# Altium schematic sheet State.schdoc: State Machine
size A; Organization: Altium Limited; Address1: L3, 12a Rodborough Rd; Address2: Frenchs Forest; Address3: NSW; Address4: Australia 2086; DocumentNumber: 1; SheetNumber: 1; SheetTotal: 1
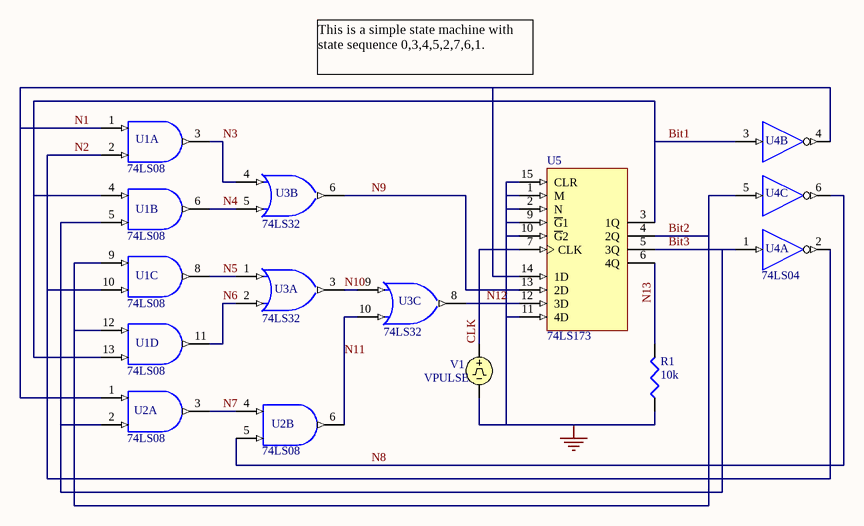
[diagram p0: State.schdoc]

## Parts
R1  10k
U1  74LS08  (parts A,B,C,D of 4)
U2  74LS08  (parts A,B of 4)
U3  74LS32  (parts A,B,C of 4)
U4  74LS04  (parts A,B,C of 6)
U5  74LS173
V1  VPULSE

## Nets
GND: R1.2(BOT) U1.7(GND) U2.7(GND) U3.7(GND) U4.7(GND) U5.1(M) U5.2(N) U5.8(GND) U5.9(~{G}1) U5.10(~{G}2) U5.11(4D) U5.15(CLR) V1.2
VCC: U1.14(VCC) U2.14(VCC) U3.14(VCC) U4.14(VCC) U5.16(VCC)
Bit1: U1.4(A) U1.13(B) U4.3(A) U5.3(1Q)
Bit2: U1.9(A) U1.12(A) U4.5(A) U5.4(2Q)
Bit3: U1.5(B) U2.2(B) U4.1(A) U5.5(3Q)
CLK: U5.7(CLK) V1.1
N1: U1.1(A) U2.1(A) U4.4(Y) U5.14(1D)
N2: U1.2(B) U1.10(B) U4.2(Y)
N3: U1.3(Y) U3.4(A)
N4: U1.6(Y) U3.5(B)
N5: U1.8(Y) U3.1(A)
N6: U1.11(Y) U3.2(B)
N7: U2.3(Y) U2.4(A)
N8: U2.5(B) U4.6(Y)
N9: U3.6(Y) U5.13(2D)
N10: U3.3(Y) U3.9(A)
N11: U2.6(Y) U3.10(B)
N12: U3.8(Y) U5.12(3D)
N13: R1.1(TOP) U5.6(4Q)

## Notes on the sheet
- This is a simple state machine with state sequence 0,3,4,5,2,7,6,1.
- Title
- Size:
- Date:
- A
- Number:
- Time:
- Revision:
- Sheet
- of
- File:

## Library data of the parts
R1 = RES: Resistor; Value: 10k
U1 U2 = 74LS08: Quad 2-Input Positive-AND Gate
U3 = 74LS32: Quad 2-Input positive-OR Gate
U4 = 74LS04: Hex Inverter
U5 = 74LS173: 4-Bit D-Type Register with 3-State Outputs
V1 = VPULSE: Pulse Voltage Source